# EAGLE design RJ45-adapter (EAGLE 9.2.2)
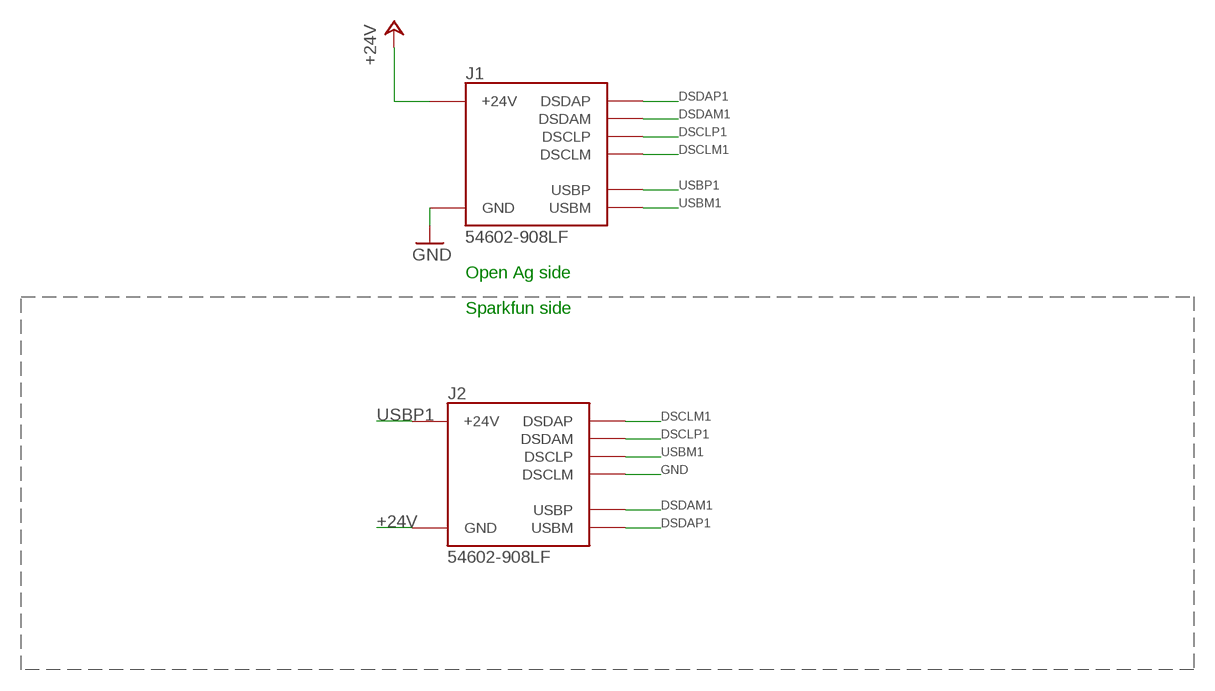
[diagram p0: schematic, sheet 1]

## Parts
J1  54602-908LF  OPENAG-V1-RJ45PTH  [OPENAG-V1-RJ45]
J2  54602-908LF  OPENAG-V1-RJ45PTH  [OPENAG-V1-RJ45]

## Nets
+24V: J1.24V(6)(+24V) J2.GND(3)(GND)
DSCLM1: J1.DSCLM(5)(DSCLM) J2.DSDAP(1)(DSDAP)
DSCLP1: J1.DSCLP(4)(DSCLP) J2.DSDAM(2)(DSDAM)
DSDAM1: J1.DSDAM(2)(DSDAM) J2.USBP(7)(USBP)
DSDAP1: J1.DSDAP(1)(DSDAP) J2.USBM(8)(USBM)
GND: J1.GND(3)(GND) J2.DSCLM(5)(DSCLM)
USBM1: J1.USBM(8)(USBM) J2.DSCLP(4)(DSCLP)
USBP1: J1.USBP(7)(USBP) J2.24V(6)(+24V)

## Notes on the sheet
- Open Ag side
- Sparkfun side

## Library data of the parts
J1 J2 = openag_connector:OPENAG-V1-RJ45: Amphenol FCI - 54602-908LF - CONN MOD JACK 8P8C R/A UNSHLD Description: Jack Modular Connector 8p8c (RJ45, Ethernet) 90� Angle (Right) Unshielded Cat3 Technical Specifications: Connector Type: Jack Number of Positions/Contacts: 8p8c (RJ45, Ethernet) Number of Ports: 1 Number of Rows: 1 Mounting Type: Through Hole Orientation: 90� Angle (Right) Termination: Solder Shielding: Unshielded Ratings: Cat3 Features: Board Lock LED Color: Does Not Contain LED Tab Direction: Down Contact Material: Copper Alloy Contact Finish: Gold Contact Finish Thickness: 15�in (0.38�m) Housing Material: Polyester, Glass Filled Operating Temperature: -40�C ~ 70�C Datasheet(s): 54601-x04(zzz)WPLF Drawing <http://cdn.amphenol-icc.com/media/wysiwyg/files/drawing/c-bmj-0102.pdf> Vendor(s): Digikey: 609-1046-ND <https://www.digikey.com/product-detail/en/amphenol-fci/54602-908LF/609-1046-ND/1001360>; POPULATE: YES; VERIFIED: NO

## Board
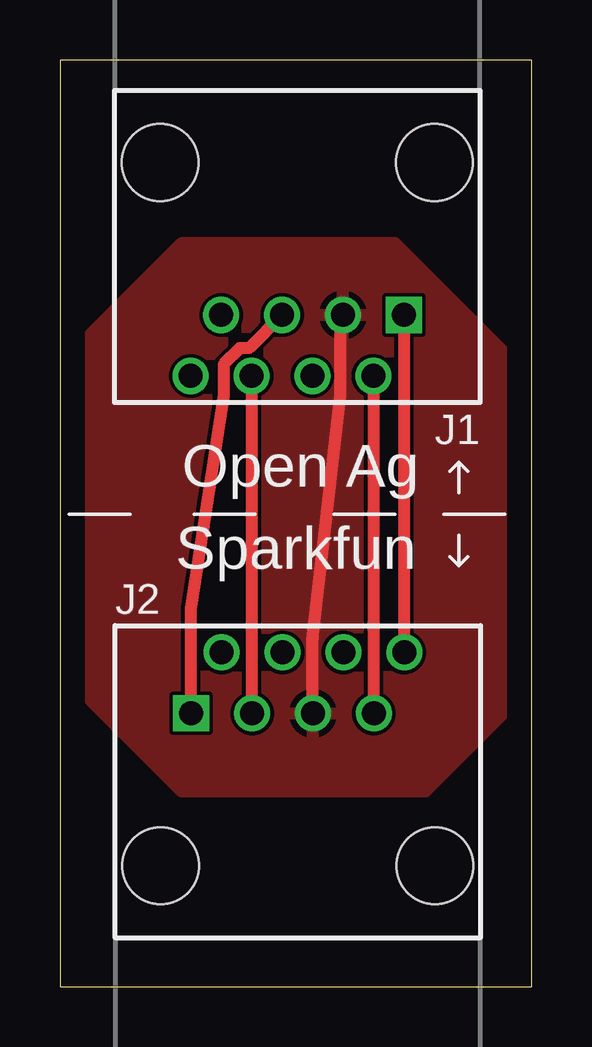
[diagram p1: board, top side]
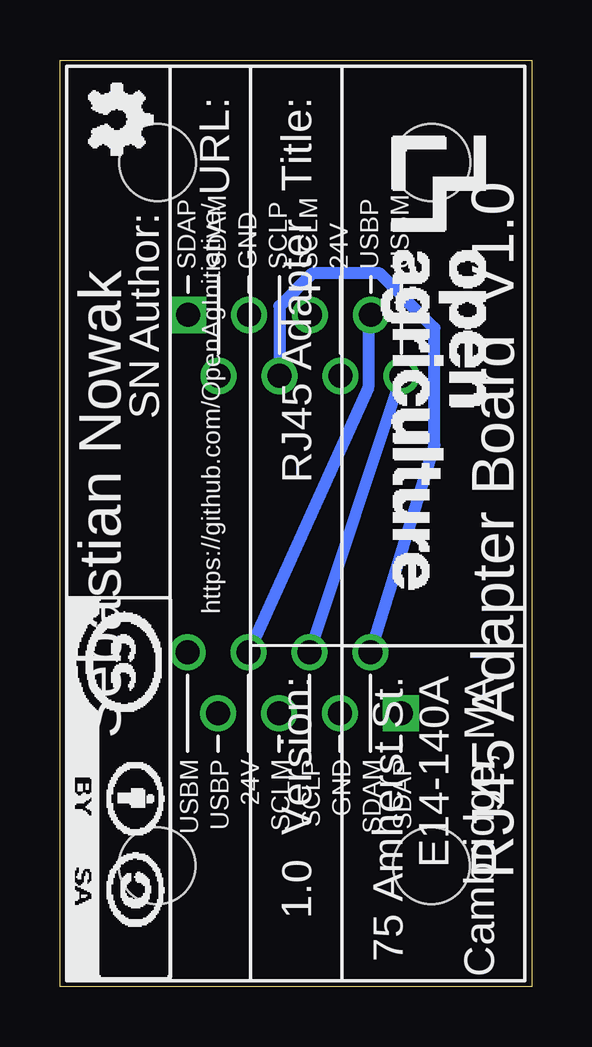
[diagram p2: board, bottom side, seen from below]

Size 19.69 x 38.61 mm. Coordinates in mm from the lower left corner, seen from the top.
Outline: 0,0 19.69,0 19.69,38.61 0,38.61 0,0
Copper layers (1*16): Top 0.035mm / dielectric 1.5mm / Bottom 0.035mm
Design rules "default": minimum track width 6mil, minimum drill 0.35mm, track to track 6mil, track to pad 6mil, pad to pad 6mil, via to via 6mil, smd to smd 6mil, copper to edge 40mil, drill to drill 6mil, minimum pad ring 10mil, minimum via ring 8mil, stop-mask expansion 4mil, vias tented up to drill 0mil, thermal gap 10mil

### Footprints (pad centres in the part's own frame; a part is rotated, then mirrored left to right if it is on the bottom)
OPENAG-V1-RJ45 = drill 1: 24V(6) 1.905,8.89; DSCLM(5) 0.635,6.35; DSCLP(4) -0.635,8.89; DSDAM(2) -3.175,8.89; GND(3) -1.905,6.35; USBM(8) 4.445,8.89; USBP(7) 3.175,6.35 | drill 1 square: DSDAP(1) -4.445,6.35 | hole 3.2: -5.715,0; 5.715,0

### Placement (x,y rotation side)
ATTRIBUTES  [DOCFIELD]  19.41,38.34 270 bottom
J1  9.9,34.33 180 top
J2  9.92,5.04 0 top

### Tracks (layer width: path | path; a pad name or v marks a point on that pad's centre or on a via)
+24V
  Top 0.508: J1.24V(6) 7.99,11.41 J2.GND(3)
DSCLM1
  Top 0.508: J2.DSDAP(1) 5.45,11.4 5.45,15.75 6.83,24.64 6.83,25.92 7.51,26.6 7.88,26.6 J1.DSCLM(5)
DSCLP1
  Bottom 0.508: J2.DSDAM(2) 4.06,22.56 4.06,27.43 6.35,29.72 9.17,29.72 10.53,28.35 J1.DSCLP(4)
DSDAM1
  Top 0.508: J1.DSDAM(2) 13.07,11.41 J2.USBP(7)
DSDAP1
  Top 0.508: J1.DSDAP(1) 14.34,13.95 J2.USBM(8)
GND
  Top 0.508: J1.GND(3) 11.69,27.87 11.69,24.64 10.53,14.48 10.53,11.4 J2.DSCLM(5)
  pour Top: 5.08,30.99 13.97,30.99 19.05,25.91 19.05,11.94 15.24,8.13 5.08,8.13 1.27,11.94 1.27,27.18
USBM1
  Bottom 0.508: J1.USBM(8) J2.DSCLP(4)
USBP1
  Bottom 0.508: J1.USBP(7) 6.83,27.87 6.83,24.96 J2.24V(6)

### Text on the board
tPlace: Open Ag | Sparkfun
bPlace: V1.0 | Sebastian Nowak | RJ45 Adapter Board